# Altium project Amplifier.PrjPcb
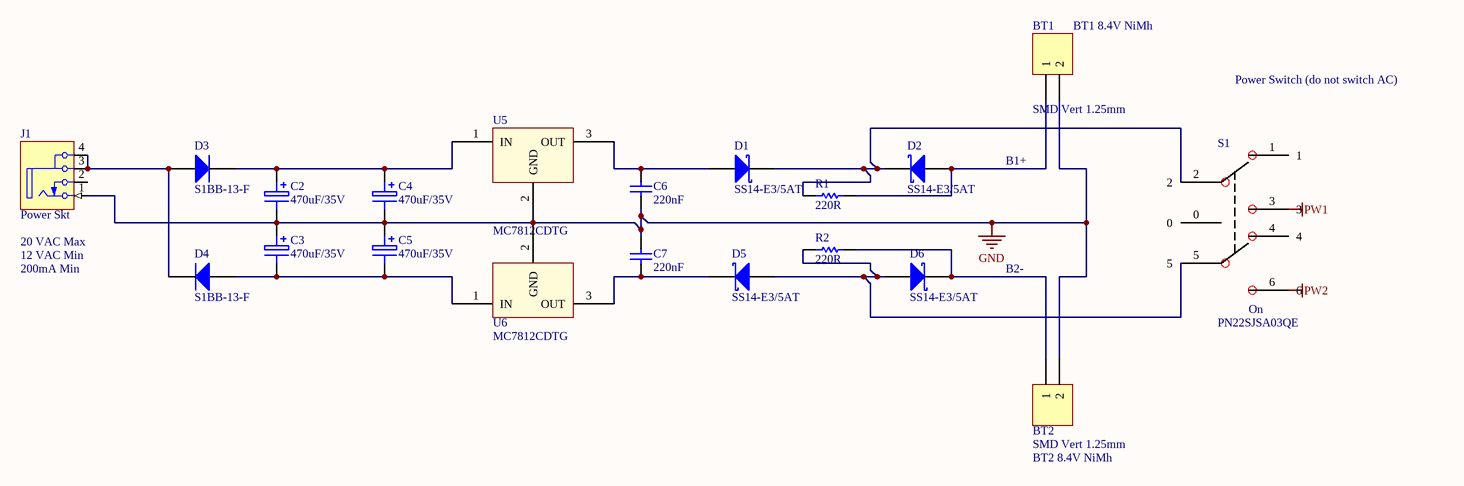
[diagram p0: AC Power Supply.SchDoc]
3 sheets, 71 parts. Net scope: global (net labels, ports and power ports of the same name join across sheets).
Board file: Amplifier.PcbDoc
Sheets:
  AC Power Supply.SchDoc
  Power Management.SchDoc
  Main.SchDoc

## Sheet AC Power Supply.SchDoc: AC Power Supply
size A4; DrawnBy: Benjamin Williams; Address1: ECE Department; Address2: University of Canterbury; Address3: Christchurch 8041; Address4: New Zealand; Revision: 1; SheetNumber: 1; SheetTotal: 3

### Parts
BT1  SMD Vert 1.25mm  [SD-53398-0219]
BT2  SMD Vert 1.25mm  [SD-53398-0219]
C2  470uF/35V  [EEE-FK1V471SP]
C3  470uF/35V  [EEE-FK1V471SP]
C4  470uF/35V  [EEE-FK1V471SP]
C5  470uF/35V  [EEE-FK1V471SP]
C6  220nF  [CAPC1608L]
C7  220nF  [CAPC1608L]
D1  SS14-E3/5AT  [DIOM4227X23N]
D2  SS14-E3/5AT  [DIOM4227X23N]
D3  S1BB-13-F  [S1BB-13-F]
D4  S1BB-13-F  [S1BB-13-F]
D5  SS14-E3/5AT  [DIOM4227X23N]
D6  SS14-E3/5AT  [DIOM4227X23N]
J1  Power Skt  [1613_14]
R1  220R  [RESC1608L]
R2  220R  [RESC1608L]
S1  PN22SJSA03QE  [PN22SJSA03QE - duplicate]
U5  MC7812CDTG  [MC7812CDTRKG]
U6  MC7812CDTG  [MC7812CDTRKG]

### Nets
GND: BT1.2 BT2.2 C2.1 C3.2 C4.1 C5.2 C6.1 C7.2 J1.1(T) U5.2(GND) U6.2(GND)
NetBT1_1: BT1.1 D2.2(A) R1.2
NetBT2_1: BT2.1 D6.1(K) R2.2
NetC2_2: C2.2 C4.2 D3.3(K) U5.1(IN)
NetC3_1: C3.1 C5.1 D4.1(A) U6.1(IN)
NetC6_2: C6.2 D1.2(A) U5.3(OUT)
NetC7_1: C7.1 D5.1(K) U6.3(OUT)
NetD1_1: D1.1(K) D2.1(K) R1.1
NetD3_1: D3.1(A) D4.3(K) J1.3(S) J1.4(S)
NetD5_2: D5.2(A) D6.2(A) R2.1

Not connected (* = marked no-connect by the designer): J1 2(TN); S1 0 1 2 3 4 5 6

### Notes on the sheet
- (near BT1) BT1 8.4V NiMh
- Power Switch (do not switch AC)
- B1+
- (near J1) 20 VAC Max
- 12 VAC Min
- 200mA Min
- B2-
- BT2 8.4V NiMh
- Labels drawn without touching a wire or pin: PW1, PW2
- Title
- Drawn by:
- Date:
- Time:
- Revision:
- Sheet
- of
- File:
- (in symbol PN22SJSA03QE) On

### Library data of the parts
BT1 BT2 = JB_53398-02: Header_Vert_2Pos_1.25mm_125V@1A_SMT; Manufacturer: Molex Inc; Manufacturer Part Number: 0533980271; Number of Positions: 2; Pitch: 0.049" (1.25mm); Contact Type: Blade Pin; Mounting Type: Surface Mount; Supplier 1: Digi-Key; Supplier Part Number 1: WM7606CT-ND; Supplier: ECE Dept; Storage Location: PCB Assembly WS; Value: SMD Vert 1.25mm
C2-C5 = CA_470uF_16V: CAP ALUM 470uF 35V SMD; Manufacturer: Panasonic; Manufacturer PN: EEE-FK1V471SP; Supplier 1: Digi-Key; Supplier Part Number 1: P18963CT-ND; Storage Location: PCB Assembly WS; Supplier: ECE Dept; Value: 470uF/35V
C6 C7 = CC_220nF_0603: CAP CER 220nF Y5V -20% +80% 25V 0603; PackageReference: 0603; Code_IPC: 1608 [0603]; Verify: *; Supplier: ECE Dept; Storage Location: PCB Assembly WS; MoV: 25V; Value: 220nF
D1 D2 D5 D6 = DS_SS14E3: DIODE, SCHOTTKY, 1A, 40V, DO-214AC; Manufacturer: VISHAY GENERAL SEMICONDUCTOR; Diode Case Style: DO-214; Forward Current If(AV): 1; Diode Type: Schottky; Package / Case: SMA; Supplier 1: Digi-Key; Supplier Part Number 1: SS14-E3/5ATGICT-ND; Supplier 2: Farnell; Supplier Part Number 2: 9551280; Supplier 3: Mouser; Supplier Part Number 3: 625-SS14-E3/11T; Storage Location: PCB Assembly WS; Supplier: ECE Dept; Manufacturer Part Number: SS14-E3/5AT
D3 D4 = DR_BAS16TT1G: Diode Switching, Vr 75V, 200mA, SOT-416; Manufacturer: ON Semiconductor; Supplier 1: Digi-Key; Supplier Part Number 1: S1BB-FDICT-ND; Supplier 2: ECE Stock; Manufacturer PN: S1BB-13-F; Storage Location: PCB Assembly WS; Supplier: ECE Dept; Value: S1BB-13-F
J1 = JP_1613 14: Power supply chassis socket, SMD, Right Angle, with break contacts, 24V DC, 3.5A; Supplier 1: Farnell; Supplier Part Number 1: 1243245; Supplier: ECE Dept; Storage Location: PCB Assembly WS
R1 R2 = RS_220R: RES 220 OHM 1/10W 5% 0603 SMD; Storage Location: PCB Assembly WS; Supplier: ECE Dept; Value: 220R
U5 U6 = SV_TLV70233DBVR: IC REG LDO 3.3V 0.3A SOT23-5; Manufacturer: ON Semiconductor; Current - Output: 1A; Supplier 1: Digi-Key; Operating Temperature: 0°C ~ 125°C; Package / Case: DPAK-3; Pricing: 1=0.77, 10=0.647, 25=0.5672, 100=0.4853, 250=0.421, 500=0.35658, 750=0.30789, 1000=0.2749 (NZD); Supplier Part Number 1: MC7812CDTGOS-ND; Manufacturer Part Number: MC7812CDTG

## Sheet Power Management.SchDoc: Power Management
size A4; DrawnBy: Benjamin Williams; Address1: ECE Department; Address2: University of Canterbury; Address3: Christchurch 8041; Address4: New Zealand; Revision: 1; SheetNumber: 2; SheetTotal: 3
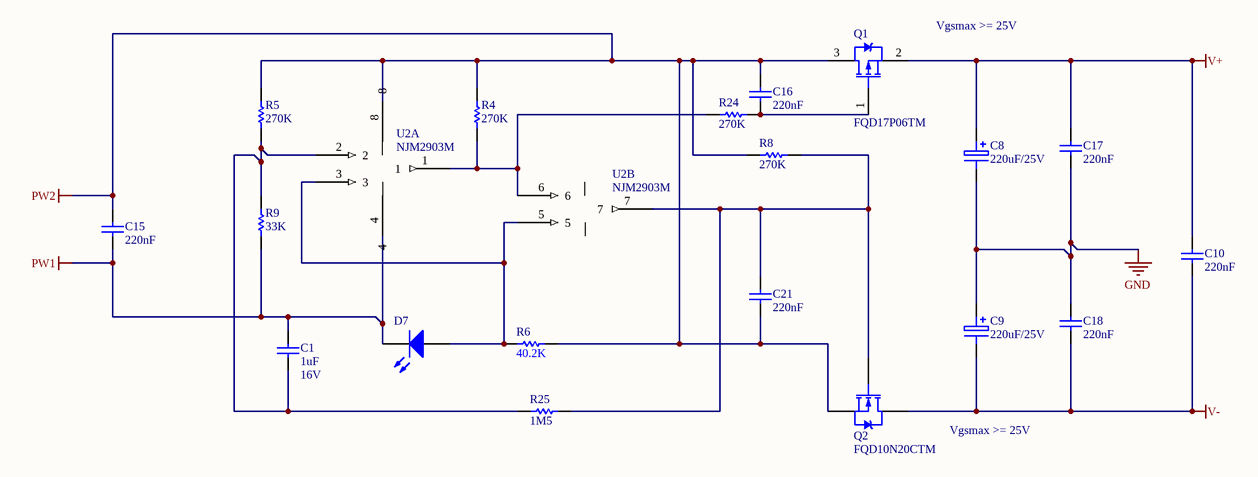
[diagram p1: Power Management.SchDoc]

### Parts
C1  Max Voltage: 16V  [CAPC1608L]  (hidden comment: 1uF)
C8  220uF/25V  [UUQ1E221MCL1GS]
C9  220uF/25V  [UUQ1E221MCL1GS]
C10  220nF  [CAPC1608L]
C15  220nF  [CAPC1608L]
C16  220nF  [CAPC1608L]
C17  220nF  [CAPC1608L]
C18  220nF  [CAPC1608L]
C21  220nF  [CAPC1608L]
D7  H-E RED  [MV5764.MP4B]  (value not drawn)
Q1  FQD17P06TM  [FQD17P06TM]
Q2  FQD10N20CTM  [FQD10N20CTM]
R4  270K  [RESC1608L]
R5  270K  [RESC1608L]
R6  40.2K  [RESC1608L]
R8  270K  [RESC1608L]
R9  33K  [RESC1608L]
R24  270K  [RESC1608L]
R25  1M5  [RESC1608L]
U2  NJM2903M  [NJM2903M]  (parts A,B of 2)

### Nets
GND: C8.1 C9.2 C17.1 C18.2
PW1: C1.2 C15.1 D7.1(K) R9.1
PW2: C15.2 C16.2 C21.1 Q1.3 Q2.3(S) R4.2 R5.2 R6.2 R8.1
V+: C8.2 C10.2 C17.2 Q1.2
V-: C9.1 C10.1 C18.1 Q2.2(D)
NetC1_1: C1.1 R5.1 R9.2 R25.1 U2.2
NetC16_1: C16.1 Q1.1 R24.2
NetC21_2: C21.2 Q2.1(G) R8.2 R25.2 U2.7
NetD7_2: D7.2(A) R6.1 U2.3 U2.5
NetR4_1: R4.1 R24.1 U2.1 U2.6

Not connected (* = marked no-connect by the designer): U2 4 8

### Notes on the sheet
- Vgsmax >= 25V
- Title
- Drawn by:
- Date:
- Time:
- Revision:
- Sheet
- of
- File:

### Library data of the parts
C1 = CC_1uF_0603: CAP CER 1uF Y5V -20% +80% 16V 0603; PackageReference: 0603; Code_IPC: 1608 [0603]; Verify: *; Supplier: ECE Dept; Storage Location: PCB Assembly WS; Value: 1uF
C8 C9 = CA_100uF_16V: 220µF 25V Aluminum Capacitors Radial, Can - SMD 1000 Hrs @ 105°C; Manufacturer PN: UWX1C101MCL1GB; Manufacturer: Nichcon; Supplier 1: Digi-Key; Supplier Part Number 1: 493-3204-1-ND; Storage Location: PCB Assembly WS; Supplier: ECE Dept; Supplier 2: Digi-Key; Supplier Part Number 2: 493-2105-1-ND; Value: 220uF/25V
C10 C15-C18 C21 = CC_220nF_0603: CAP CER 220nF Y5V -20% +80% 25V 0603; PackageReference: 0603; Code_IPC: 1608 [0603]; Verify: *; Supplier: ECE Dept; Storage Location: PCB Assembly WS; MoV: 25V; Value: 220nF
D7 = DL_150060BS75000: LED Blue 270mcd 0603 SMD; Manufacturer: WURTH ELEKTRONIK; Forward Current If: 30; Forward Voltage: 3.2; Luminous Intensity: 270; Viewing Angle: 120°; Wavelength Typ: 470; Pricing: 1=0.3844, 50=0.3252, 100=0.2957, 500=0.2365 (NZD); Supplier 1: Farnell; Supplier Part Number 1: 2322069; Manufacturer Part Number: MV5764.MP4B; Storage Location: PCB Assembly WS; Supplier: ECE Dept; LED Colour: H-E RED
Q1 = TM_SSM3J328R: P-Channel 60V 12A (Tc) 2.5W (Ta), 44W (Tc) Surface Mount D-Pak; FET Feature: Logic Level Gate, 1.5V Drive; FET Type: MOSFET P-Channel, Metal Oxide; Gate Charge (Qg) @ Vgs: 27nC @ 10V; Input Capacitance (Ciss) @ Vds: 900pF @ 25V; Vgs(th) (Max) @ Id: 4V @ 250µA; Current - Continuous Drain (Id) @ 25° C: 12A (Tc); Drain to Source Voltage (Vdss): 60V; Package / Case: SOT-23-3 Flat Leads; Power - Max: 2.5W (Ta), 44W (Tc); Supplier Device Package: SOT-23F; Pricing: 1=0.79, 10=0.658, 25=0.5772, 100=0.4939, 250=0.42836, 500=0.36284, 1000=0.27972 (NZD); Supplier 1: Digi-Key; Supplier Part Number 1: SSM3J328RLF(ACT-ND; Supplier 2: Mouser; Supplier Part Number 2: N/A; Supplier Part Number: SSM3J328RLF(ACT-ND; Storage Location: PCB Assembly WS; Supplier: ECE Dept; Manufacturer Part Number: FQD17P06TM
Q2 = NMOS-2: N-Channel Power MOSFET; Note: Pin 2 is electrically connected to pin 4.; Published: 8-Jun-2000; LatestRevisionDate: 17-Jul-2002; LatestRevisionNote: Re-released for DXP Platform.; DatasheetVersion: PD-9.814; PackageVersion: Feb-1997; PackageReference: D-Pak; Publisher: Altium Limited; PackageDescription: TO-252-3, DPak (2 Leads + Tab), SC-63; ComponentLink1Description: Manufacturer Link; ComponentLink1URL: http://www.irf.com/
R4 R5 R8 R24 = RS_270K: RES 270K OHM 1/10W 5% 0603 SMD; Storage Location: PCB Assembly WS; Supplier: ECE Dept; Value: 270K
R6 = RS_43K: RES 43K OHM 1/10W 5% 0603 SMD; Storage Location: PCB Assembly WS; Supplier: ECE Dept; Value: 40.2K
R9 = RS_33K: RES 33.0K OHM 1/10W 5% 0603 SMD; Storage Location: PCB Assembly WS; Supplier: ECE Dept; Value: 33K
R25 = RS_1M5: RES 1.5M OHM 1/10W 5% 0603 SMD; Supplier: ECE Dept; Storage Location: PCB Assembly WS; Value: 1M5
U2 = NJM2903D

## Sheet Main.SchDoc: Gain Switch
size A4; DrawnBy: bgw50; Address1: ECE Department; Address2: University of Canterbury; Address3: Christchurch 8041; Address4: New Zealand; Revision: 1; SheetNumber: 3; SheetTotal: 3
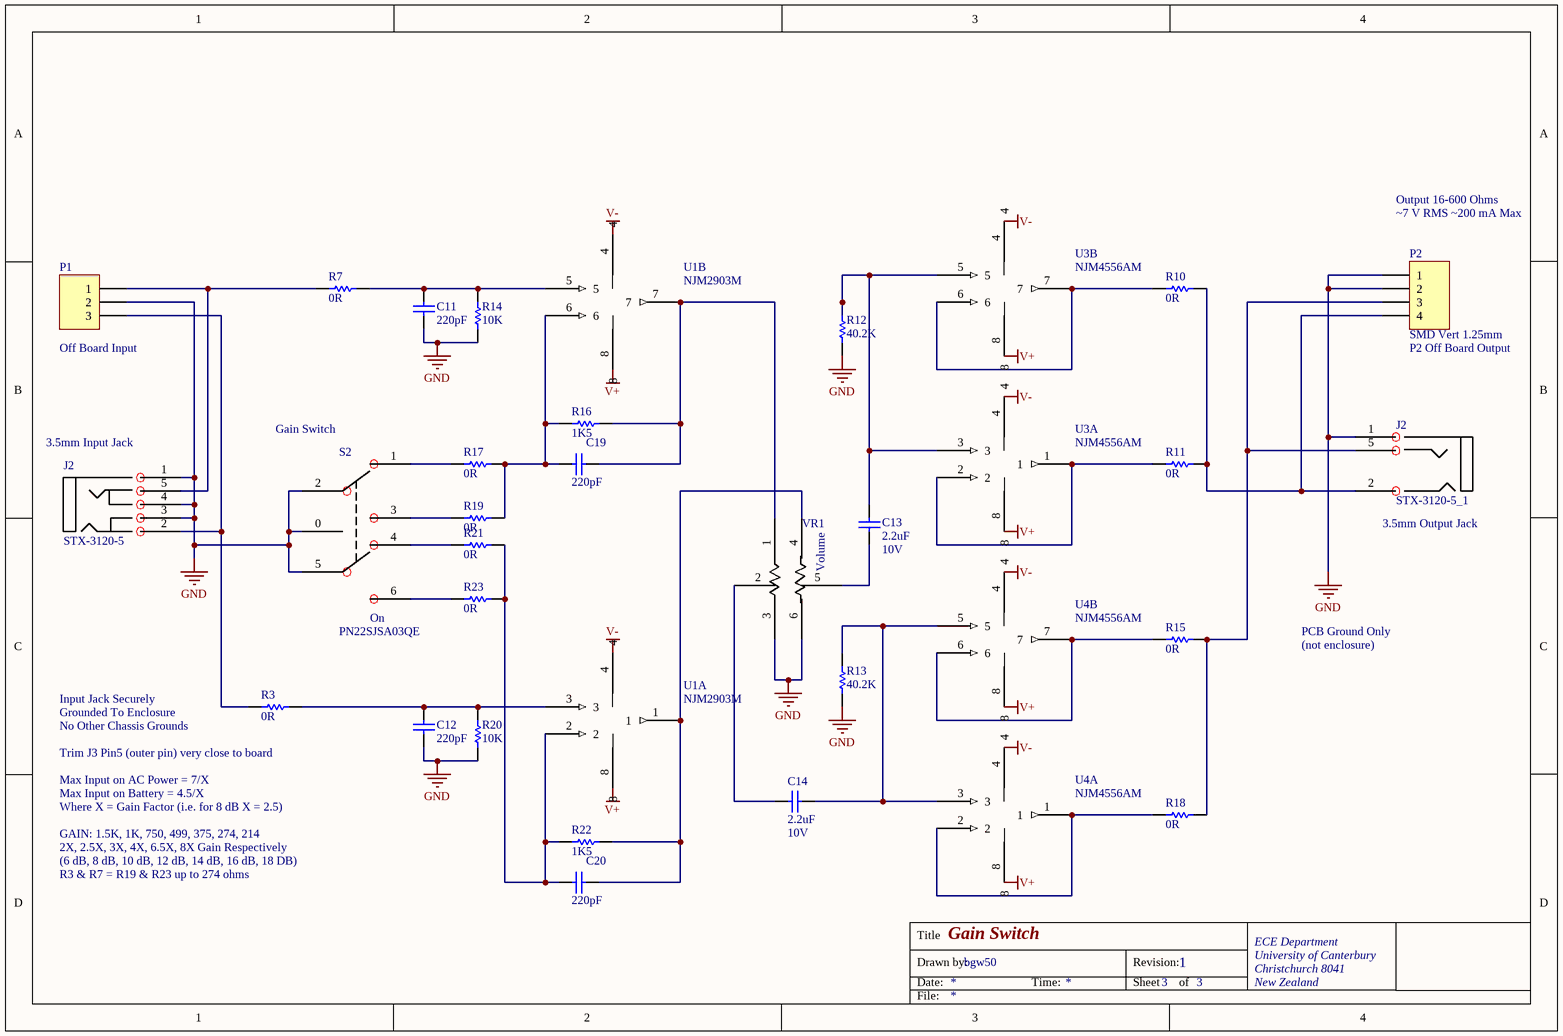
[diagram p2: Main.SchDoc]

### Parts
(Parts that share a designator on the sheet are numbered #1, #2 ... from top to bottom, then left to right.)
C11  220pF  [CAPC1608L]
C12  220pF  [CAPC1608L]
C13  Max Voltage: 10V  [CAPC1608L]  (hidden comment: 2.2uF)
C14  Max Voltage: 10V  [CAPC1608L]  (hidden comment: 2.2uF)
C19  220pF  [CAPC1608L]
C20  220pF  [CAPC1608L]
J2#1  STX-3120-5_1
J2#2  STX-3120-5
P1  SMD Horiz 1.25mm  [SD-53261-0319]  (value not drawn)
P2  SMD Vert 1.25mm  [SD-53398-0419]
R3  0R  [RESC1608L]
R7  0R  [RESC1608L]
R10  0R  [RESC1608L]
R11  0R  [RESC1608L]
R12  40.2K  [RESC1608L]
R13  40.2K  [RESC1608L]
R14  10K  [RESC1608L]
R15  0R  [RESC1608L]
R16  1K5  [RESC1608L]
R17  0R  [RESC1608L]
R18  0R  [RESC1608L]
R19  0R  [RESC1608L]
R20  10K  [RESC1608L]
R21  0R  [RESC1608L]
R22  1K5  [RESC1608L]
R23  0R  [RESC1608L]
S2  PN22SJSA03QE
U1  NJM2903M  [NJM2903M]  (parts A,B of 2)
U3  NJM4556AM  [NJM2903M]  (parts A,B of 2)
U4  NJM4556AM  [NJM2903M]  (parts A,B of 2)
VR1  (no value)

### Nets
GND: C11.1 C12.1 P1.2 P2.1 P2.2 R12.1 R13.1 R14.1 R20.1 VR1.3 VR1.6
NetC11_2: C11.2 R7.2 R14.2 U1.5
NetC12_2: C12.2 R3.2 R20.2 U1.3
NetC13_1: C13.1 VR1.5
NetC13_2: C13.2 R12.2 U3.3 U3.5
NetC14_1: C14.1 VR1.2
NetC14_2: C14.2 R13.2 U4.3 U4.5
NetC19_1: C19.1 R16.1 R17.2 R19.2 U1.6
NetC19_2: C19.2 R16.2 U1.7 VR1.1
NetC20_1: C20.1 R21.2 R22.1 R23.2 U1.2
NetC20_2: C20.2 R22.2 U1.1 VR1.4
NetP1_1: P1.1 R7.1
NetP1_3: P1.3 R3.1
NetP2_3: P2.3 R15.2 R18.2
NetP2_4: P2.4 R10.2 R11.2
NetR10_1: R10.1 U3.6 U3.7
NetR11_1: R11.1 U3.1 U3.2
NetR15_1: R15.1 U4.6 U4.7
NetR18_1: R18.1 U4.1 U4.2

Not connected (* = marked no-connect by the designer): J2#1 1 2 5; J2#2 1 2 3 4 5; R17 1; R19 1; R21 1; R23 1; S2 0 1 2 3 4 5 6; U1 4 8; U3 4 8; U4 4 8

### Notes on the sheet
- Output 16-600 Ohms
- ~7 V RMS ~200 mA Max
- (near P1) Off Board Input
- (near P2) P2 Off Board Output
- (near J2#2) 3.5mm Input Jack
- (near S2) Gain Switch
- (near VR1) Volume
- (near J2#1) 3.5mm Output Jack
- PCB Ground Only
- (not enclosure)
- Input Jack Securely
- Grounded To Enclosure
- No Other Chassis Grounds
- (near R3) Trim J3 Pin5 (outer pin) very close to board
- Max Input on AC Power = 7/X
- Max Input on Battery = 4.5/X
- Where X = Gain Factor (i.e. for 8 dB X = 2.5)
- GAIN: 1.5K, 1K, 750, 499, 375, 274, 214
- 2X, 2.5X, 3X, 4X, 6.5X, 8X Gain Respectively
- (6 dB, 8 dB, 10 dB, 12 dB, 14 dB, 16 dB, 18 DB)
- R3 & R7 = R19 & R23 up to 274 ohms
- Labels drawn without touching a wire or pin: V+, V-
- Title
- Drawn by:
- Date:
- Time:
- Revision:
- Sheet
- of
- File:
- (in symbol PN22SJSA03QE) On

### Library data of the parts
C11 C12 C19 C20 = CC_220pF_0603: CAP CER 220pF NPO/COG +-5% 50V 0603; PackageReference: 0603; Code_IPC: 1608 [0603]; Verify: *; Supplier: ECE Dept; Storage Location: PCB Assembly WS; Value: 220pF
C13 C14 = CC_2.2uF_0603: CAP CER 2.2uF X5R +-20% 10V 0603; PackageReference: 0603; Code_IPC: 1608 [0603]; Verify: *; Supplier: ECE Dept; Storage Location: PCB Assembly WS; Value: 2.2uF
P1 = JB_53261-03: Header_Horiz_3Pos_1.25mm_125V@1A_SMT; Manufacturer: Molex; Manufacturer Part Number: 53261-0390; Number of Positions: 3; Pitch: 0.049" (1.25mm); Contact Type: Blade Pin; Mounting Type: Surface Mount, Right Angle; Supplier 1: Farnell; Supplier Part Number 1: 1125359; Supplier 2: Digi-Key; Supplier Part Number 2: WM1754CT-ND; Supplier: ECE Dept; Storage Location: PCB Assembly WS; Value: SMD Horiz 1.25mm
P2 = JB_53398-04: Header_Vert_4Pos_1.25mm_125V@1A_SMT; Manufacturer: MOLEX; Manufacturer Part Number: 53398-0471; Contact Termination: Surface Mount Vertical; Current Rating: 1; Lead Spacing: 1.25; Series: PicoBlade; Supplier 1: Farnell; Supplier Part Number 1: 1125367; Supplier: ECE Dept; Storage Location: PCB Assembly WS; Value: SMD Vert 1.25mm
R3 R7 R10 R11 R15 R17-R19 R21 R23 = RS_0R0: RES 0.0 OHM 1/10W 5% 0603 SMD; Storage Location: PCB Assembly WS; Supplier: ECE Dept; Value: 0R
R12 R13 = RS_39K: RES 39K OHM 1/10W 5% 0603 SMD; Storage Location: PCB Assembly WS; Supplier: ECE Dept; Value: 40.2K
R14 R20 = RS_10K: RES 10.0K OHM 1/10W 5% 0603 SMD; Storage Location: PCB Assembly WS; Supplier: ECE Dept; Value: 10K
R16 R22 = RS_1K5: RES 1.5K OHM 1/10W 5% 0603 SMD; Storage Location: PCB Assembly WS; Supplier: ECE Dept; Value: 1K5
U1 U3 U4 = NJM2903D
VR1 = RK09

## Nets that join several sheets
GND: AC Power Supply (11 pins), Power Management (C8.1 C9.2 C17.1 C18.2), Main (11 pins)